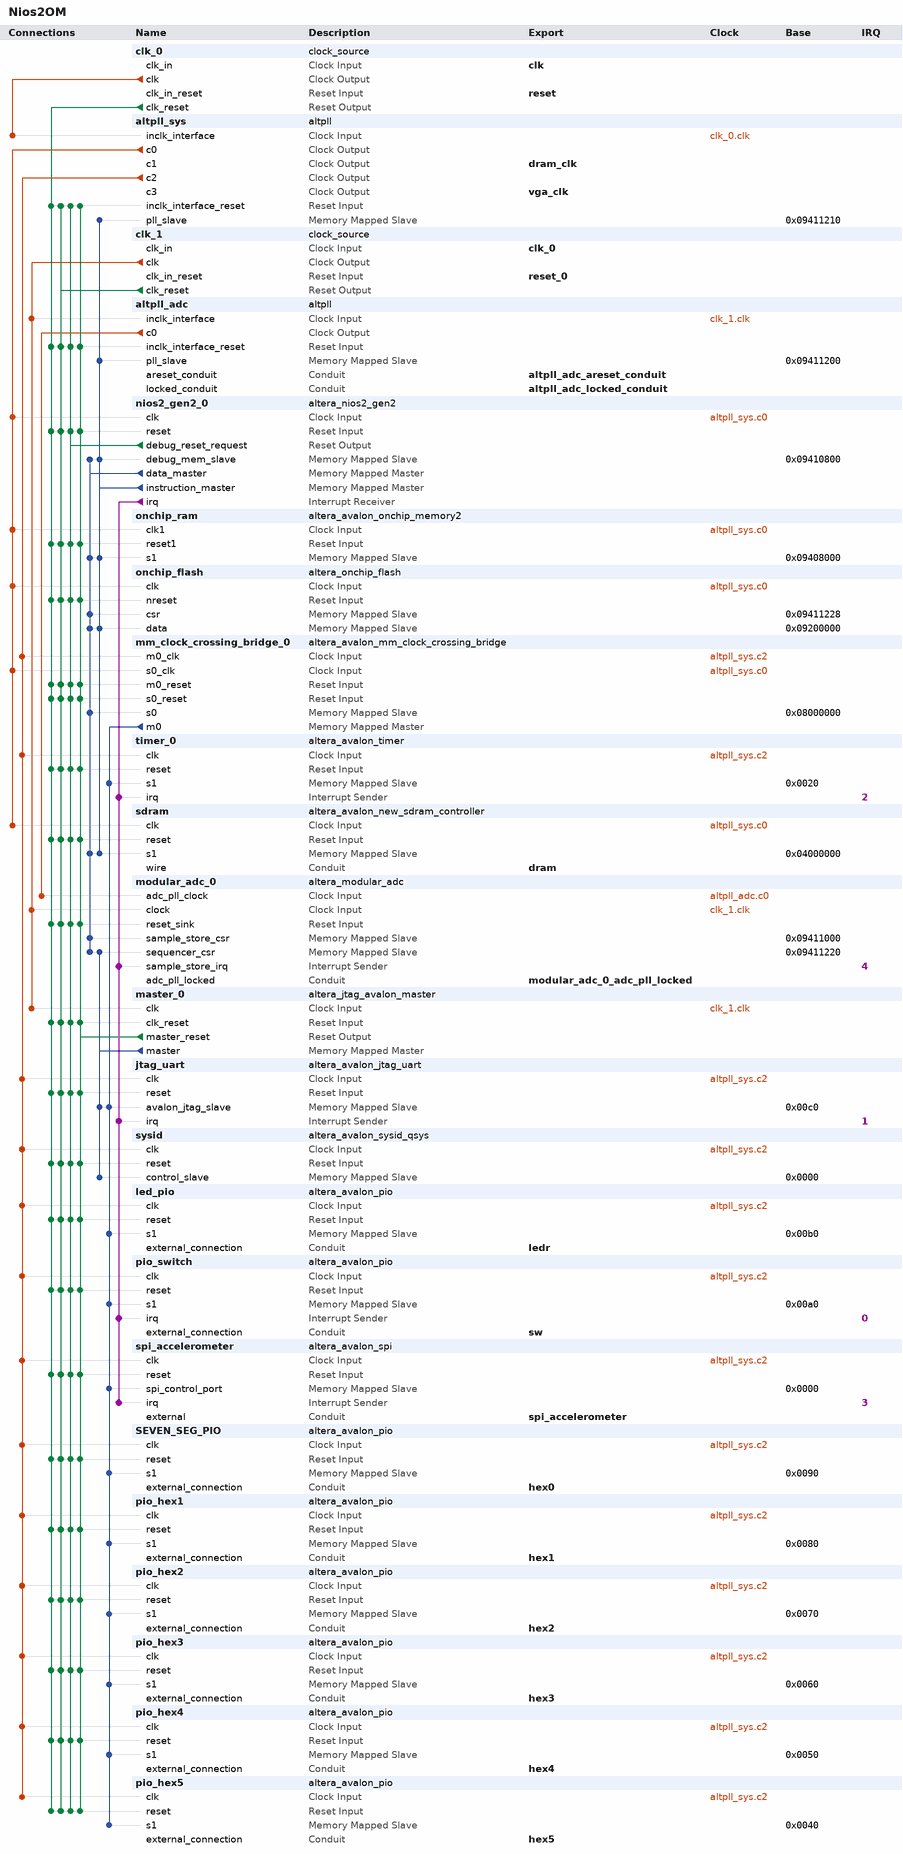
[diagram p0: system contents]
# Platform Designer (Qsys) system Nios2OM, MAX 10 10M50DAF484C6GES
# Parameters at their usual value, and those the tool derives, are not listed.
package require -exact qsys 16.1
create_system Nios2OM
set_project_property DEVICE_FAMILY {MAX 10}
set_project_property DEVICE 10M50DAF484C6GES

add_instance clk_0 clock_source 16.1
set_instance_parameter_value clk_0 clockFrequency 50000000

add_instance altpll_sys altpll 16.1
set_instance_parameter_value altpll_sys CLK0_DIVIDE_BY 1
set_instance_parameter_value altpll_sys CLK0_MULTIPLY_BY 2
set_instance_parameter_value altpll_sys CLK1_DIVIDE_BY 1
set_instance_parameter_value altpll_sys CLK1_DUTY_CYCLE 50
set_instance_parameter_value altpll_sys CLK1_MULTIPLY_BY 2
set_instance_parameter_value altpll_sys CLK1_PHASE_SHIFT -2500
set_instance_parameter_value altpll_sys CLK2_DIVIDE_BY 1
set_instance_parameter_value altpll_sys CLK2_DUTY_CYCLE 50
set_instance_parameter_value altpll_sys CLK2_MULTIPLY_BY 1
set_instance_parameter_value altpll_sys CLK2_PHASE_SHIFT 0
set_instance_parameter_value altpll_sys CLK3_DIVIDE_BY 2
set_instance_parameter_value altpll_sys CLK3_DUTY_CYCLE 50
set_instance_parameter_value altpll_sys CLK3_MULTIPLY_BY 1
set_instance_parameter_value altpll_sys CLK3_PHASE_SHIFT 0
set_instance_parameter_value altpll_sys INCLK0_INPUT_FREQUENCY 20000
set_instance_parameter_value altpll_sys PORT_ARESET PORT_UNUSED
set_instance_parameter_value altpll_sys PORT_LOCKED PORT_UNUSED
set_instance_parameter_value altpll_sys PORT_clk1 PORT_USED
set_instance_parameter_value altpll_sys PORT_clk2 PORT_USED
set_instance_parameter_value altpll_sys PORT_clk3 PORT_USED

add_instance clk_1 clock_source 16.1
set_instance_parameter_value clk_1 clockFrequency 10000000

add_instance altpll_adc altpll 16.1
set_instance_parameter_value altpll_adc CLK0_DIVIDE_BY 1
set_instance_parameter_value altpll_adc CLK0_MULTIPLY_BY 1
set_instance_parameter_value altpll_adc INCLK0_INPUT_FREQUENCY 100000
set_instance_parameter_value altpll_adc PORT_ARESET PORT_USED
set_instance_parameter_value altpll_adc PORT_LOCKED PORT_USED
set_instance_parameter_value altpll_adc PORT_clk1 PORT_UNUSED
set_instance_parameter_value altpll_adc PORT_clk2 PORT_UNUSED
set_instance_parameter_value altpll_adc PORT_clk3 PORT_UNUSED

add_instance nios2_gen2_0 altera_nios2_gen2 16.1
set_instance_parameter_value nios2_gen2_0 dcache_size 2048
set_instance_parameter_value nios2_gen2_0 debug_hwbreakpoint 2
set_instance_parameter_value nios2_gen2_0 dividerType srt2
set_instance_parameter_value nios2_gen2_0 exceptionSlave onchip_ram.s1
set_instance_parameter_value nios2_gen2_0 icache_size 2048
set_instance_parameter_value nios2_gen2_0 impl Fast
set_instance_parameter_value nios2_gen2_0 mmu_TLBMissExcOffset 256
set_instance_parameter_value nios2_gen2_0 mmu_TLBMissExcSlave nios2_gen2_0.debug_mem_slave
set_instance_parameter_value nios2_gen2_0 mmu_autoAssignTlbPtrSz false
set_instance_parameter_value nios2_gen2_0 mul_64_impl 1
set_instance_parameter_value nios2_gen2_0 mul_shift_choice 1
set_instance_parameter_value nios2_gen2_0 resetSlave onchip_ram.s1

add_instance onchip_ram altera_avalon_onchip_memory2 16.1
set_instance_parameter_value onchip_ram dataWidth 32
set_instance_parameter_value onchip_ram dualPort false
set_instance_parameter_value onchip_ram initMemContent true
set_instance_parameter_value onchip_ram initializationFileName onchip_mem.hex
set_instance_parameter_value onchip_ram memorySize 32768

add_instance onchip_flash altera_onchip_flash 16.1
set_instance_parameter_value onchip_flash CLOCK_FREQUENCY 100.0
set_instance_parameter_value onchip_flash CONFIGURATION_MODE {Single Uncompressed Image with Memory Initialization}
set_instance_parameter_value onchip_flash SECTOR_ACCESS_MODE {Read and write,Read and write,Read and write,Read and write,Read and write}
set_instance_parameter_value onchip_flash initFlashContent false
set_instance_parameter_value onchip_flash initializationFileName altera_onchip_flash.hex
set_instance_parameter_value onchip_flash useNonDefaultInitFile false

add_instance mm_clock_crossing_bridge_0 altera_avalon_mm_clock_crossing_bridge 16.1
set_instance_parameter_value mm_clock_crossing_bridge_0 ADDRESS_UNITS WORDS
set_instance_parameter_value mm_clock_crossing_bridge_0 ADDRESS_WIDTH 10
set_instance_parameter_value mm_clock_crossing_bridge_0 COMMAND_FIFO_DEPTH 8
set_instance_parameter_value mm_clock_crossing_bridge_0 DATA_WIDTH 32
set_instance_parameter_value mm_clock_crossing_bridge_0 MASTER_SYNC_DEPTH 2
set_instance_parameter_value mm_clock_crossing_bridge_0 MAX_BURST_SIZE 1
set_instance_parameter_value mm_clock_crossing_bridge_0 RESPONSE_FIFO_DEPTH 32
set_instance_parameter_value mm_clock_crossing_bridge_0 SLAVE_SYNC_DEPTH 2
set_instance_parameter_value mm_clock_crossing_bridge_0 USE_AUTO_ADDRESS_WIDTH 0

add_instance timer_0 altera_avalon_timer 16.1
set_instance_parameter_value timer_0 period 1
set_instance_parameter_value timer_0 periodUnits MSEC

add_instance sdram altera_avalon_new_sdram_controller 16.1
set_instance_parameter_value sdram TAC 5.5
set_instance_parameter_value sdram TRCD 20.0
set_instance_parameter_value sdram TRP 20.0
set_instance_parameter_value sdram casLatency 3
set_instance_parameter_value sdram columnWidth 10
set_instance_parameter_value sdram dataWidth 16
set_instance_parameter_value sdram generateSimulationModel true
set_instance_parameter_value sdram model single_Micron_MT48LC4M32B2_7_chip
set_instance_parameter_value sdram numberOfBanks 4
set_instance_parameter_value sdram numberOfChipSelects 1
set_instance_parameter_value sdram powerUpDelay 100.0
set_instance_parameter_value sdram refreshPeriod 15.625
set_instance_parameter_value sdram rowWidth 13

add_instance modular_adc_0 altera_modular_adc 16.1
set_instance_parameter_value modular_adc_0 CLOCK_FREQ 10000000
set_instance_parameter_value modular_adc_0 CORE_VAR 0
set_instance_parameter_value modular_adc_0 DEVICE_PART 10M50DAF484C6GES
set_instance_parameter_value modular_adc_0 ENABLE_DEBUG 1
set_instance_parameter_value modular_adc_0 clkdiv 2
set_instance_parameter_value modular_adc_0 int_vref_vr 3.0
set_instance_parameter_value modular_adc_0 refsel 0
set_instance_parameter_value modular_adc_0 sample_rate 0
set_instance_parameter_value modular_adc_0 seq_order_length 1
set_instance_parameter_value modular_adc_0 seq_order_slot_1 1
set_instance_parameter_value modular_adc_0 seq_order_slot_2 30
set_instance_parameter_value modular_adc_0 seq_order_slot_3 30
set_instance_parameter_value modular_adc_0 seq_order_slot_4 30
set_instance_parameter_value modular_adc_0 seq_order_slot_5 30
set_instance_parameter_value modular_adc_0 seq_order_slot_6 30
set_instance_parameter_value modular_adc_0 seq_order_slot_7 30
set_instance_parameter_value modular_adc_0 use_ch0 false
set_instance_parameter_value modular_adc_0 use_ch2 false
set_instance_parameter_value modular_adc_0 use_ch3 false
set_instance_parameter_value modular_adc_0 use_ch4 false
set_instance_parameter_value modular_adc_0 use_ch5 false
set_instance_parameter_value modular_adc_0 use_ch6 false
set_instance_parameter_value modular_adc_0 use_ch7 false
set_instance_parameter_value modular_adc_0 use_ch8 false
set_instance_parameter_value modular_adc_0 use_tsd false

add_instance master_0 altera_jtag_avalon_master 16.1

add_instance jtag_uart altera_avalon_jtag_uart 16.1
set_instance_parameter_value jtag_uart simInteractiveOptions NO_INTERACTIVE_WINDOWS

add_instance sysid altera_avalon_sysid_qsys 16.1
set_instance_parameter_value sysid id 0

add_instance led_pio altera_avalon_pio 16.1
set_instance_parameter_value led_pio direction Output
set_instance_parameter_value led_pio width 10

add_instance pio_switch altera_avalon_pio 16.1
set_instance_parameter_value pio_switch captureEdge true
set_instance_parameter_value pio_switch direction Input
set_instance_parameter_value pio_switch edgeType ANY
set_instance_parameter_value pio_switch generateIRQ true
set_instance_parameter_value pio_switch simDoTestBenchWiring true
set_instance_parameter_value pio_switch simDrivenValue 1023
set_instance_parameter_value pio_switch width 10

add_instance spi_accelerometer altera_avalon_spi 16.1
set_instance_parameter_value spi_accelerometer clockPhase 1
set_instance_parameter_value spi_accelerometer clockPolarity 1
set_instance_parameter_value spi_accelerometer dataWidth 8
set_instance_parameter_value spi_accelerometer masterSPI true
set_instance_parameter_value spi_accelerometer numberOfSlaves 1
set_instance_parameter_value spi_accelerometer targetClockRate 128000

add_instance SEVEN_SEG_PIO altera_avalon_pio 16.1
set_instance_parameter_value SEVEN_SEG_PIO direction Output
set_instance_parameter_value SEVEN_SEG_PIO width 8

add_instance pio_hex1 altera_avalon_pio 16.1
set_instance_parameter_value pio_hex1 direction Output
set_instance_parameter_value pio_hex1 width 8

add_instance pio_hex2 altera_avalon_pio 16.1
set_instance_parameter_value pio_hex2 direction Output
set_instance_parameter_value pio_hex2 width 8

add_instance pio_hex3 altera_avalon_pio 16.1
set_instance_parameter_value pio_hex3 direction Output
set_instance_parameter_value pio_hex3 width 8

add_instance pio_hex4 altera_avalon_pio 16.1
set_instance_parameter_value pio_hex4 direction Output
set_instance_parameter_value pio_hex4 width 8

add_instance pio_hex5 altera_avalon_pio 16.1
set_instance_parameter_value pio_hex5 direction Output
set_instance_parameter_value pio_hex5 width 8

# connections
add_connection altpll_adc.c0 modular_adc_0.adc_pll_clock clock
add_connection altpll_sys.c0 mm_clock_crossing_bridge_0.s0_clk clock
add_connection altpll_sys.c0 nios2_gen2_0.clk clock
add_connection altpll_sys.c0 onchip_flash.clk clock
add_connection altpll_sys.c0 onchip_ram.clk1 clock
add_connection altpll_sys.c0 sdram.clk clock
add_connection altpll_sys.c2 jtag_uart.clk clock
add_connection altpll_sys.c2 led_pio.clk clock
add_connection altpll_sys.c2 mm_clock_crossing_bridge_0.m0_clk clock
add_connection altpll_sys.c2 pio_hex1.clk clock
add_connection altpll_sys.c2 pio_hex2.clk clock
add_connection altpll_sys.c2 pio_hex3.clk clock
add_connection altpll_sys.c2 pio_hex4.clk clock
add_connection altpll_sys.c2 pio_hex5.clk clock
add_connection altpll_sys.c2 pio_switch.clk clock
add_connection altpll_sys.c2 SEVEN_SEG_PIO.clk clock
add_connection altpll_sys.c2 spi_accelerometer.clk clock
add_connection altpll_sys.c2 sysid.clk clock
add_connection altpll_sys.c2 timer_0.clk clock
add_connection clk_0.clk altpll_sys.inclk_interface clock
add_connection clk_1.clk altpll_adc.inclk_interface clock
add_connection clk_1.clk master_0.clk clock
add_connection clk_1.clk modular_adc_0.clock clock
add_connection clk_0.clk_reset altpll_adc.inclk_interface_reset reset
add_connection clk_0.clk_reset altpll_sys.inclk_interface_reset reset
add_connection clk_0.clk_reset jtag_uart.reset reset
add_connection clk_0.clk_reset led_pio.reset reset
add_connection clk_0.clk_reset master_0.clk_reset reset
add_connection clk_0.clk_reset mm_clock_crossing_bridge_0.m0_reset reset
add_connection clk_0.clk_reset mm_clock_crossing_bridge_0.s0_reset reset
add_connection clk_0.clk_reset modular_adc_0.reset_sink reset
add_connection clk_0.clk_reset nios2_gen2_0.reset reset
add_connection clk_0.clk_reset onchip_flash.nreset reset
add_connection clk_0.clk_reset onchip_ram.reset1 reset
add_connection clk_0.clk_reset pio_hex1.reset reset
add_connection clk_0.clk_reset pio_hex2.reset reset
add_connection clk_0.clk_reset pio_hex3.reset reset
add_connection clk_0.clk_reset pio_hex4.reset reset
add_connection clk_0.clk_reset pio_hex5.reset reset
add_connection clk_0.clk_reset pio_switch.reset reset
add_connection clk_0.clk_reset sdram.reset reset
add_connection clk_0.clk_reset SEVEN_SEG_PIO.reset reset
add_connection clk_0.clk_reset spi_accelerometer.reset reset
add_connection clk_0.clk_reset sysid.reset reset
add_connection clk_0.clk_reset timer_0.reset reset
add_connection clk_1.clk_reset altpll_adc.inclk_interface_reset reset
add_connection clk_1.clk_reset altpll_sys.inclk_interface_reset reset
add_connection clk_1.clk_reset jtag_uart.reset reset
add_connection clk_1.clk_reset led_pio.reset reset
add_connection clk_1.clk_reset master_0.clk_reset reset
add_connection clk_1.clk_reset mm_clock_crossing_bridge_0.m0_reset reset
add_connection clk_1.clk_reset mm_clock_crossing_bridge_0.s0_reset reset
add_connection clk_1.clk_reset modular_adc_0.reset_sink reset
add_connection clk_1.clk_reset nios2_gen2_0.reset reset
add_connection clk_1.clk_reset onchip_flash.nreset reset
add_connection clk_1.clk_reset onchip_ram.reset1 reset
add_connection clk_1.clk_reset pio_hex1.reset reset
add_connection clk_1.clk_reset pio_hex2.reset reset
add_connection clk_1.clk_reset pio_hex3.reset reset
add_connection clk_1.clk_reset pio_hex4.reset reset
add_connection clk_1.clk_reset pio_hex5.reset reset
add_connection clk_1.clk_reset pio_switch.reset reset
add_connection clk_1.clk_reset sdram.reset reset
add_connection clk_1.clk_reset SEVEN_SEG_PIO.reset reset
add_connection clk_1.clk_reset spi_accelerometer.reset reset
add_connection clk_1.clk_reset sysid.reset reset
add_connection clk_1.clk_reset timer_0.reset reset
add_connection master_0.master_reset altpll_adc.inclk_interface_reset reset
add_connection master_0.master_reset altpll_sys.inclk_interface_reset reset
add_connection master_0.master_reset jtag_uart.reset reset
add_connection master_0.master_reset led_pio.reset reset
add_connection master_0.master_reset master_0.clk_reset reset
add_connection master_0.master_reset mm_clock_crossing_bridge_0.m0_reset reset
add_connection master_0.master_reset mm_clock_crossing_bridge_0.s0_reset reset
add_connection master_0.master_reset modular_adc_0.reset_sink reset
add_connection master_0.master_reset nios2_gen2_0.reset reset
add_connection master_0.master_reset onchip_flash.nreset reset
add_connection master_0.master_reset onchip_ram.reset1 reset
add_connection master_0.master_reset pio_hex1.reset reset
add_connection master_0.master_reset pio_hex2.reset reset
add_connection master_0.master_reset pio_hex3.reset reset
add_connection master_0.master_reset pio_hex4.reset reset
add_connection master_0.master_reset pio_hex5.reset reset
add_connection master_0.master_reset pio_switch.reset reset
add_connection master_0.master_reset sdram.reset reset
add_connection master_0.master_reset SEVEN_SEG_PIO.reset reset
add_connection master_0.master_reset spi_accelerometer.reset reset
add_connection master_0.master_reset sysid.reset reset
add_connection master_0.master_reset timer_0.reset reset
add_connection nios2_gen2_0.debug_reset_request altpll_adc.inclk_interface_reset reset
add_connection nios2_gen2_0.debug_reset_request altpll_sys.inclk_interface_reset reset
add_connection nios2_gen2_0.debug_reset_request jtag_uart.reset reset
add_connection nios2_gen2_0.debug_reset_request led_pio.reset reset
add_connection nios2_gen2_0.debug_reset_request master_0.clk_reset reset
add_connection nios2_gen2_0.debug_reset_request mm_clock_crossing_bridge_0.m0_reset reset
add_connection nios2_gen2_0.debug_reset_request mm_clock_crossing_bridge_0.s0_reset reset
add_connection nios2_gen2_0.debug_reset_request modular_adc_0.reset_sink reset
add_connection nios2_gen2_0.debug_reset_request nios2_gen2_0.reset reset
add_connection nios2_gen2_0.debug_reset_request onchip_flash.nreset reset
add_connection nios2_gen2_0.debug_reset_request onchip_ram.reset1 reset
add_connection nios2_gen2_0.debug_reset_request pio_hex1.reset reset
add_connection nios2_gen2_0.debug_reset_request pio_hex2.reset reset
add_connection nios2_gen2_0.debug_reset_request pio_hex3.reset reset
add_connection nios2_gen2_0.debug_reset_request pio_hex4.reset reset
add_connection nios2_gen2_0.debug_reset_request pio_hex5.reset reset
add_connection nios2_gen2_0.debug_reset_request pio_switch.reset reset
add_connection nios2_gen2_0.debug_reset_request sdram.reset reset
add_connection nios2_gen2_0.debug_reset_request SEVEN_SEG_PIO.reset reset
add_connection nios2_gen2_0.debug_reset_request spi_accelerometer.reset reset
add_connection nios2_gen2_0.debug_reset_request sysid.reset reset
add_connection nios2_gen2_0.debug_reset_request timer_0.reset reset
add_connection master_0.master jtag_uart.avalon_jtag_slave avalon
set_connection_parameter_value master_0.master/jtag_uart.avalon_jtag_slave baseAddress 0x00c0
add_connection master_0.master modular_adc_0.sequencer_csr avalon
set_connection_parameter_value master_0.master/modular_adc_0.sequencer_csr baseAddress 0x09411220
add_connection master_0.master sysid.control_slave avalon
set_connection_parameter_value master_0.master/sysid.control_slave baseAddress 0x0000
add_connection mm_clock_crossing_bridge_0.m0 jtag_uart.avalon_jtag_slave avalon
set_connection_parameter_value mm_clock_crossing_bridge_0.m0/jtag_uart.avalon_jtag_slave baseAddress 0x00c0
add_connection mm_clock_crossing_bridge_0.m0 led_pio.s1 avalon
set_connection_parameter_value mm_clock_crossing_bridge_0.m0/led_pio.s1 baseAddress 0x00b0
add_connection mm_clock_crossing_bridge_0.m0 pio_hex1.s1 avalon
set_connection_parameter_value mm_clock_crossing_bridge_0.m0/pio_hex1.s1 baseAddress 0x0080
add_connection mm_clock_crossing_bridge_0.m0 pio_hex2.s1 avalon
set_connection_parameter_value mm_clock_crossing_bridge_0.m0/pio_hex2.s1 baseAddress 0x0070
add_connection mm_clock_crossing_bridge_0.m0 pio_hex3.s1 avalon
set_connection_parameter_value mm_clock_crossing_bridge_0.m0/pio_hex3.s1 baseAddress 0x0060
add_connection mm_clock_crossing_bridge_0.m0 pio_hex4.s1 avalon
set_connection_parameter_value mm_clock_crossing_bridge_0.m0/pio_hex4.s1 baseAddress 0x0050
add_connection mm_clock_crossing_bridge_0.m0 pio_hex5.s1 avalon
set_connection_parameter_value mm_clock_crossing_bridge_0.m0/pio_hex5.s1 baseAddress 0x0040
add_connection mm_clock_crossing_bridge_0.m0 pio_switch.s1 avalon
set_connection_parameter_value mm_clock_crossing_bridge_0.m0/pio_switch.s1 baseAddress 0x00a0
add_connection mm_clock_crossing_bridge_0.m0 SEVEN_SEG_PIO.s1 avalon
set_connection_parameter_value mm_clock_crossing_bridge_0.m0/SEVEN_SEG_PIO.s1 baseAddress 0x0090
add_connection mm_clock_crossing_bridge_0.m0 spi_accelerometer.spi_control_port avalon
set_connection_parameter_value mm_clock_crossing_bridge_0.m0/spi_accelerometer.spi_control_port baseAddress 0x0000
add_connection mm_clock_crossing_bridge_0.m0 timer_0.s1 avalon
set_connection_parameter_value mm_clock_crossing_bridge_0.m0/timer_0.s1 baseAddress 0x0020
add_connection nios2_gen2_0.data_master mm_clock_crossing_bridge_0.s0 avalon
set_connection_parameter_value nios2_gen2_0.data_master/mm_clock_crossing_bridge_0.s0 baseAddress 0x08000000
add_connection nios2_gen2_0.data_master modular_adc_0.sample_store_csr avalon
set_connection_parameter_value nios2_gen2_0.data_master/modular_adc_0.sample_store_csr baseAddress 0x09411000
add_connection nios2_gen2_0.data_master modular_adc_0.sequencer_csr avalon
set_connection_parameter_value nios2_gen2_0.data_master/modular_adc_0.sequencer_csr baseAddress 0x09411220
add_connection nios2_gen2_0.data_master nios2_gen2_0.debug_mem_slave avalon
set_connection_parameter_value nios2_gen2_0.data_master/nios2_gen2_0.debug_mem_slave baseAddress 0x09410800
add_connection nios2_gen2_0.data_master onchip_flash.csr avalon
set_connection_parameter_value nios2_gen2_0.data_master/onchip_flash.csr baseAddress 0x09411228
add_connection nios2_gen2_0.data_master onchip_flash.data avalon
set_connection_parameter_value nios2_gen2_0.data_master/onchip_flash.data baseAddress 0x09200000
add_connection nios2_gen2_0.data_master onchip_ram.s1 avalon
set_connection_parameter_value nios2_gen2_0.data_master/onchip_ram.s1 baseAddress 0x09408000
add_connection nios2_gen2_0.data_master sdram.s1 avalon
set_connection_parameter_value nios2_gen2_0.data_master/sdram.s1 baseAddress 0x04000000
add_connection nios2_gen2_0.instruction_master altpll_adc.pll_slave avalon
set_connection_parameter_value nios2_gen2_0.instruction_master/altpll_adc.pll_slave baseAddress 0x09411200
add_connection nios2_gen2_0.instruction_master altpll_sys.pll_slave avalon
set_connection_parameter_value nios2_gen2_0.instruction_master/altpll_sys.pll_slave baseAddress 0x09411210
add_connection nios2_gen2_0.instruction_master nios2_gen2_0.debug_mem_slave avalon
set_connection_parameter_value nios2_gen2_0.instruction_master/nios2_gen2_0.debug_mem_slave baseAddress 0x09410800
add_connection nios2_gen2_0.instruction_master onchip_flash.data avalon
set_connection_parameter_value nios2_gen2_0.instruction_master/onchip_flash.data baseAddress 0x09200000
add_connection nios2_gen2_0.instruction_master onchip_ram.s1 avalon
set_connection_parameter_value nios2_gen2_0.instruction_master/onchip_ram.s1 baseAddress 0x09408000
add_connection nios2_gen2_0.instruction_master sdram.s1 avalon
set_connection_parameter_value nios2_gen2_0.instruction_master/sdram.s1 baseAddress 0x04000000
add_connection nios2_gen2_0.irq jtag_uart.irq interrupt
set_connection_parameter_value nios2_gen2_0.irq/jtag_uart.irq irqNumber 1
add_connection nios2_gen2_0.irq modular_adc_0.sample_store_irq interrupt
set_connection_parameter_value nios2_gen2_0.irq/modular_adc_0.sample_store_irq irqNumber 4
add_connection nios2_gen2_0.irq pio_switch.irq interrupt
set_connection_parameter_value nios2_gen2_0.irq/pio_switch.irq irqNumber 0
add_connection nios2_gen2_0.irq spi_accelerometer.irq interrupt
set_connection_parameter_value nios2_gen2_0.irq/spi_accelerometer.irq irqNumber 3
add_connection nios2_gen2_0.irq timer_0.irq interrupt
set_connection_parameter_value nios2_gen2_0.irq/timer_0.irq irqNumber 2

# exported interfaces
add_interface altpll_adc_areset_conduit conduit end
set_interface_property altpll_adc_areset_conduit EXPORT_OF altpll_adc.areset_conduit
add_interface altpll_adc_locked_conduit conduit end
set_interface_property altpll_adc_locked_conduit EXPORT_OF altpll_adc.locked_conduit
add_interface clk clock sink
set_interface_property clk EXPORT_OF clk_0.clk_in
add_interface clk_0 clock sink
set_interface_property clk_0 EXPORT_OF clk_1.clk_in
add_interface dram conduit end
set_interface_property dram EXPORT_OF sdram.wire
add_interface dram_clk clock source
set_interface_property dram_clk EXPORT_OF altpll_sys.c1
add_interface hex0 conduit end
set_interface_property hex0 EXPORT_OF SEVEN_SEG_PIO.external_connection
add_interface hex1 conduit end
set_interface_property hex1 EXPORT_OF pio_hex1.external_connection
add_interface hex2 conduit end
set_interface_property hex2 EXPORT_OF pio_hex2.external_connection
add_interface hex3 conduit end
set_interface_property hex3 EXPORT_OF pio_hex3.external_connection
add_interface hex4 conduit end
set_interface_property hex4 EXPORT_OF pio_hex4.external_connection
add_interface hex5 conduit end
set_interface_property hex5 EXPORT_OF pio_hex5.external_connection
add_interface ledr conduit end
set_interface_property ledr EXPORT_OF led_pio.external_connection
add_interface modular_adc_0_adc_pll_locked conduit end
set_interface_property modular_adc_0_adc_pll_locked EXPORT_OF modular_adc_0.adc_pll_locked
add_interface reset reset sink
set_interface_property reset EXPORT_OF clk_0.clk_in_reset
add_interface reset_0 reset sink
set_interface_property reset_0 EXPORT_OF clk_1.clk_in_reset
add_interface spi_accelerometer conduit end
set_interface_property spi_accelerometer EXPORT_OF spi_accelerometer.external
add_interface sw conduit end
set_interface_property sw EXPORT_OF pio_switch.external_connection
add_interface vga_clk clock source
set_interface_property vga_clk EXPORT_OF altpll_sys.c3

set_interconnect_requirement {$system} qsys_mm.clockCrossingAdapter HANDSHAKE
set_interconnect_requirement {$system} qsys_mm.enableEccProtection FALSE
set_interconnect_requirement {$system} qsys_mm.insertDefaultSlave FALSE
set_interconnect_requirement {$system} qsys_mm.maxAdditionalLatency 1

save_system Nios2OM.qsys
